# Altium schematic sheet MainBoard_V100_BLE.SchDoc
size A4; SheetNumber: 16; SheetTotal: 19; Title_: BLE Module
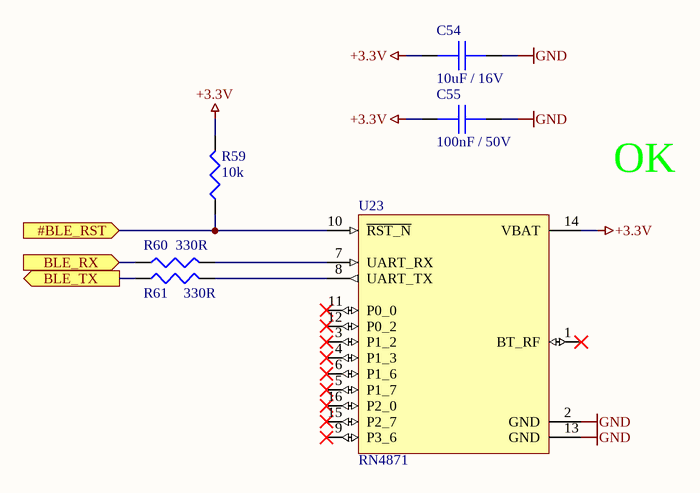
[diagram p0: MainBoard_V100_BLE.SchDoc]

## Parts
C54  10uF / 16V  [0805_C]
C55  100nF / 50V  [0805_C]
R59  10k  [0805]
R60  330R  [0805]
R61  330R  [0805]
U23  RN4871  [RN4871]

## Ports
#BLE_RST (in), BLE_RX (in), BLE_TX (out)

## Nets
+3.3V: C54.2 C55.2 R59.2 U23.14(VBAT)
GND: C54.1 C55.1 U23.2(GND) U23.13(GND)
#BLE_RST: R59.1 U23.10(~{RST_N}) ; port #BLE_RST
BLE_RX: R60.1 ; port BLE_RX
BLE_TX: R61.1 ; port BLE_TX
NetR60_2: R60.2 U23.7(UART_RX)
NetR61_2: R61.2 U23.8(UART_TX)

Not connected (* = marked no-connect by the designer): U23 1(BT_RF)* 3(P1_2)* 4(P1_3)* 5(P1_7)* 6(P1_6)* 9(P3_6)* 11(P0_0)* 12(P0_2)* 15(P2_7)* 16(P2_0)*

## Notes on the sheet
- OK
- Board:
- Author:
- Title:
- Project:
- SVN:
- Version:
- Sheet:
- of
- Contact:
- Modified:
- Size:
- A4

## Library data of the parts
C54 = 153: 10uF 16V X5R; Part Number: SMD0805-10uF-16V; Azonosító: 153; Category: Passives; Subcategory: PASS_Capacitor; Supplier 1: HESTORE; Supplier 1 order number: 100.344.52
C55 = 149: 100nF 50V X7R; Part Number: SMD0805-100nF-50V; Azonosító: 149; Category: Passives; Subcategory: PASS_Capacitor; Supplier 1: HESTORE; Supplier 1 order number: 100.011.22
R59 = 59: 10k 0805 0.125W 1%; Part Number: SMD0805-10k 1%; Azonosító: 59; Category: Passives; Subcategory: PASS_Resistor; Supplier 1: HESTORE; Supplier 1 order number: 100.403.38
R60 R61 = 48: 330R 0805 0.125W 5%; Part Number: SMD0805-330R 5%; Azonosító: 48; Category: Passives; Subcategory: PASS_Resistor; Supplier 1: HESTORE; Supplier 1 order number: 100.011.70
U23 = 391: Bluetooth Modules - 802.15.1 Bluetooth Low Energy BLE Module, Shielded, Antenna,; Azonosító: 391; Part Number: RN4871; Category: Integrated Circuits; Subcategory: IC_RF; Supplier 1: MOUSER; Supplier 1 order number: 579-RN4871-I/RM140; Help URL: https://hu.mouser.com/datasheet/2/268/RN4870_71_Bluetooth_Low_Energy_Module_DS50002489-3002868.pdf